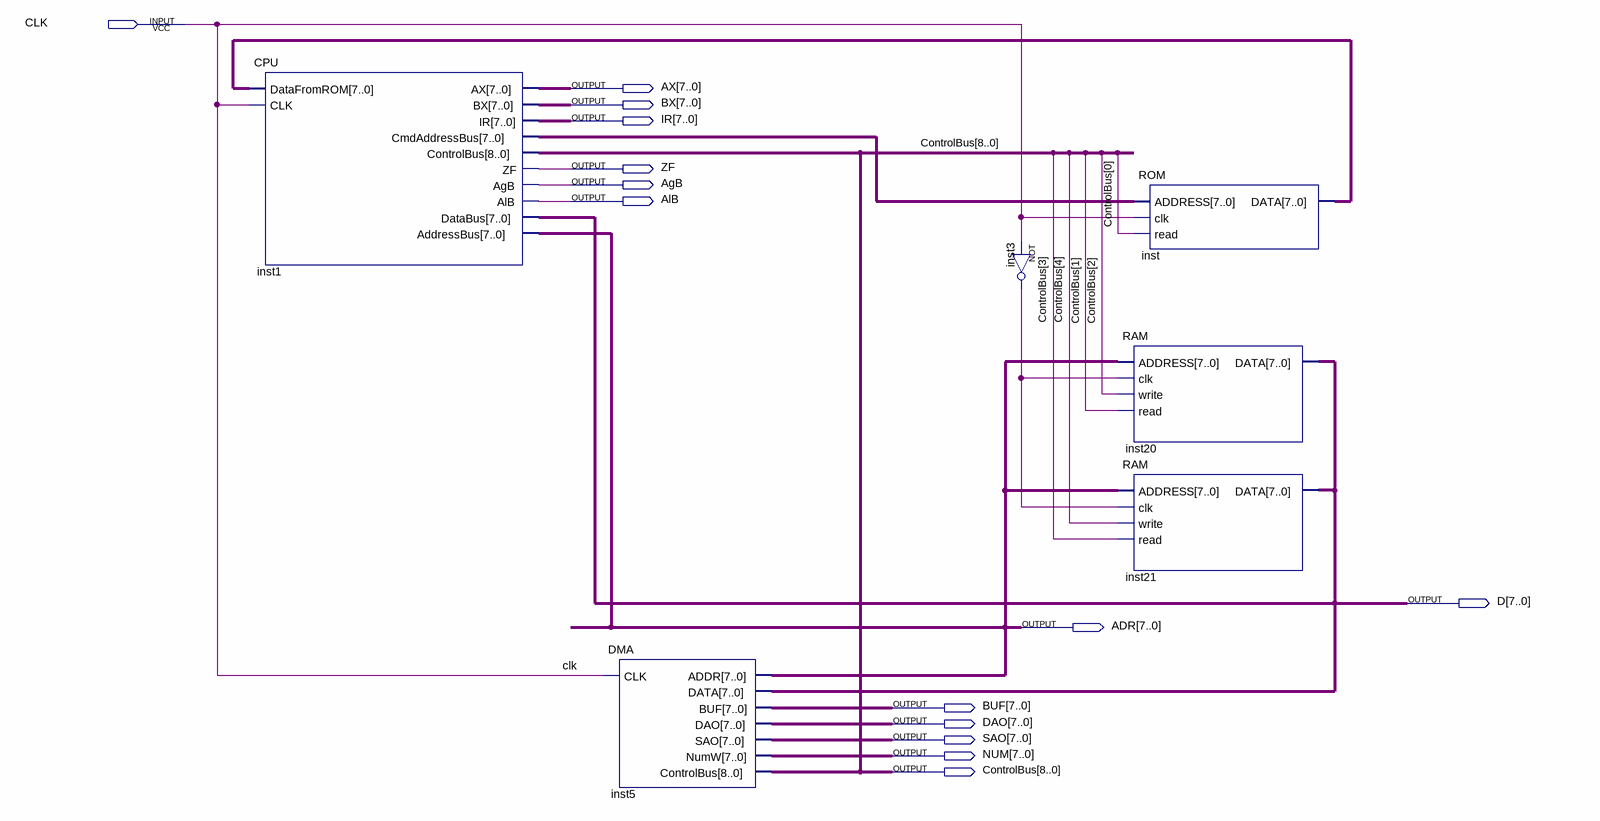
[diagram p0: schematic sheet]
// Quartus schematic MAIN.bdf as structural Verilog: 6 symbols, 14 pins
module MAIN (
  input  CLK,
  output [7:0] AX,
  output [7:0] BX,
  output [7:0] IR,
  output ZF,
  output AgB,
  output AlB,
  output [7:0] D,
  output [7:0] ADR,
  output [7:0] BUF,
  output [7:0] DAO,
  output [7:0] SAO,
  output [7:0] NUM,
  output [8:0] ControlBus
);

  wire inst3_out;
  wire [7:0] inst1_cmdaddressbus, inst_data;

  CPU inst1 (
    .DataFromROM(inst_data), .CLK(CLK), .AX(AX), .BX(BX), .IR(IR), .CmdAddressBus(inst1_cmdaddressbus),
    .ZF(ZF), .AgB(AgB), .AlB(AlB), .AddressBus(ADR), .ControlBus(ControlBus), .DataBus(D));
  DMA inst5 (.CLK(CLK), .ADDR(ADR), .BUF(BUF), .DAO(DAO), .SAO(SAO), .NumW(NUM), .DATA(D), .ControlBus(ControlBus));
  not inst3 (inst3_out, CLK);
  ROM inst (.ADDRESS(inst1_cmdaddressbus), .clk(CLK), .read(ControlBus[0]), .DATA(inst_data));
  RAM inst20 (.ADDRESS(ADR), .clk(inst3_out), .write(ControlBus[2]), .read(ControlBus[1]), .DATA(D));
  RAM inst21 (.ADDRESS(ADR), .clk(inst3_out), .write(ControlBus[4]), .read(ControlBus[3]), .DATA(D));
endmodule
